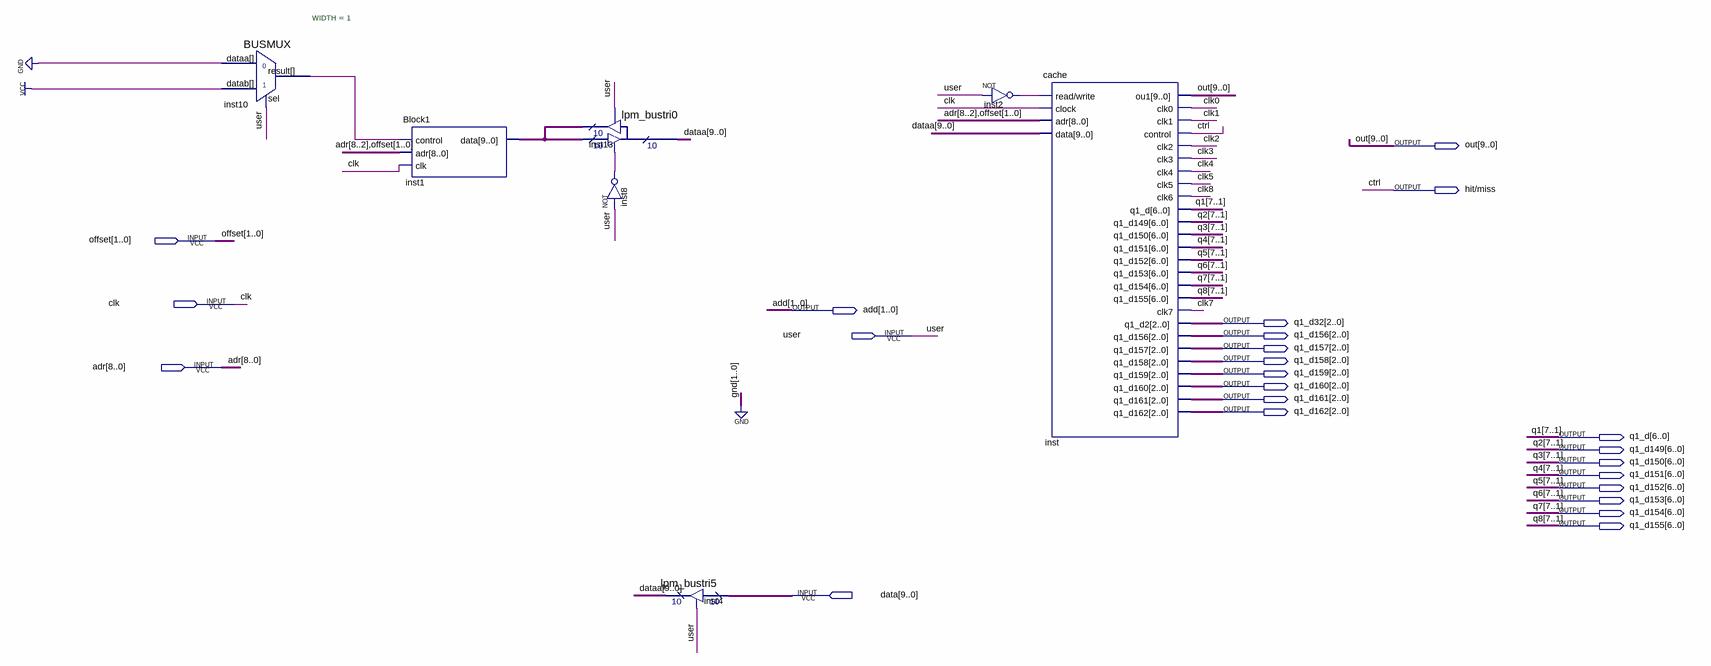
[diagram p0: schematic sheet]
// Quartus schematic Lab5.bdf as structural Verilog: 7 symbols, 24 pins
module Lab5 (
  input  [1:0] offset,
  input  clk,
  input  user,
  input  [8:0] adr,
  input  [9:0] data,
  output [9:0] out,
  output \hit/miss ,
  output [1:0] add,
  output [2:0] q1_d32,
  output [2:0] q1_d156,
  output [2:0] q1_d157,
  output [2:0] q1_d158,
  output [2:0] q1_d159,
  output [2:0] q1_d160,
  output [2:0] q1_d161,
  output [2:0] q1_d162,
  output [6:0] q1_d,
  output [6:0] q1_d149,
  output [6:0] q1_d150,
  output [6:0] q1_d151,
  output [6:0] q1_d152,
  output [6:0] q1_d153,
  output [6:0] q1_d154,
  output [6:0] q1_d155
);

  wire clk0, clk1, clk2, clk3, clk4, clk5, clk7, clk8, inst2_out, inst8_out, inst10_result;
  wire [9:0] dataa, inst1_data;

  BUSMUX #(.WIDTH(1)) inst10 (.datab(1'b1), .sel(user), .dataa(1'b0), .result(inst10_result));
  Block1 inst1 (.control(inst10_result), .adr({adr[8:2], offset}), .clk(clk), .data(inst1_data));
  lpm_bustri0 inst13 (.enabledt(inst8_out), .data(inst1_data), .enabletr(user), .result(inst1_data), .tridata(dataa));
  not inst8 (inst8_out, user);
  lpm_bustri5 inst4 (.enabledt(user), .data(data), .tridata(dataa));
  not inst2 (inst2_out, user);
  cache inst (
    .\read/write (inst2_out), .clock(clk), .adr({adr[8:2], offset}), .data(dataa), .ou1(out), .clk0(clk0),
    .clk1(clk1), .control(\hit/miss ), .clk2(clk2), .clk3(clk3), .clk4(clk4), .clk5(clk5), .clk6(clk8),
    .q1_d(q1_d), .q1_d149(q1_d149), .q1_d150(q1_d150), .q1_d151(q1_d151), .q1_d152(q1_d152),
    .q1_d153(q1_d153), .q1_d154(q1_d154), .q1_d155(q1_d155), .clk7(clk7), .q1_d2(q1_d32), .q1_d156(q1_d156),
    .q1_d157(q1_d157), .q1_d158(q1_d158), .q1_d159(q1_d159), .q1_d160(q1_d160), .q1_d161(q1_d161),
    .q1_d162(q1_d162));

  // Other names for the same wires on the sheet: ctrl = \hit/miss ; q1[7:1] = q1_d; q2[7:1] = q1_d149;
  //   q3[7:1] = q1_d150; q4[7:1] = q1_d151; q5[7:1] = q1_d152; q6[7:1] = q1_d153; q7[7:1] = q1_d154;
  //   q8[7:1] = q1_d155
endmodule
